# Altium schematic sheet MEMORIA.schdoc
size 115 x 54 mm
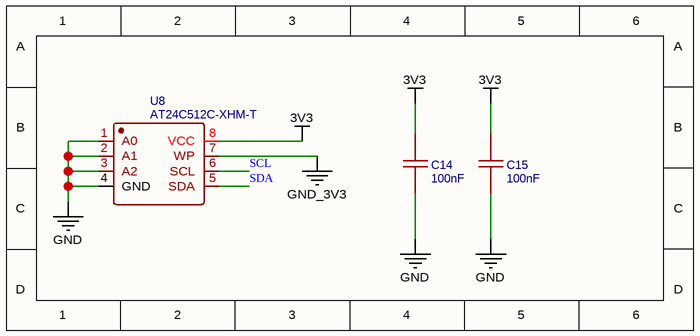
[diagram p0: MEMORIA.schdoc]

## Parts
C14  100nF  [C0805]
C15  100nF  [C0805]
U8  AT24C512C-XHM-T  [TSSOP-8_L4.4-W3.0-P0.65-LS6.4-BL]

## Nets
3V3: C14.2 C15.2 U8.8(VCC)
GND: C14.1 C15.1 U8.1(A0) U8.2(A1) U8.3(A2) U8.4(GND)
GND_3V3: U8.7(WP)
SCL: U8.6(SCL)
SDA: U8.5(SDA)

## Library data of the parts
C14 C15 = 100nF: BOM_Manufacturer Part: CC0805KRX7R9BB104; BOM_Manufacturer: YAGEO(国巨); nameAlias: Value(F); Contributor: LCEDA_Lib; BOM_Supplier Part: C49678; BOM_Supplier: LCSC; spicePre: C; spiceSymbolName: C_0805_US
U8 = AT24C512C-XHM-T: BOM_Manufacturer: MICROCHIP(美国微芯); BOM_Supplier: LCSC; BOM_Manufacturer Part: AT24C512C-XHM-T; BOM_Supplier Part: C111546; BOM_JLCPCB Part Class: Extended Part; spicePre: U; spiceSymbolName: AT24C512C-XHM-T